# EAGLE schematic citizen-scientist-v2 (EAGLE 9.6.2)
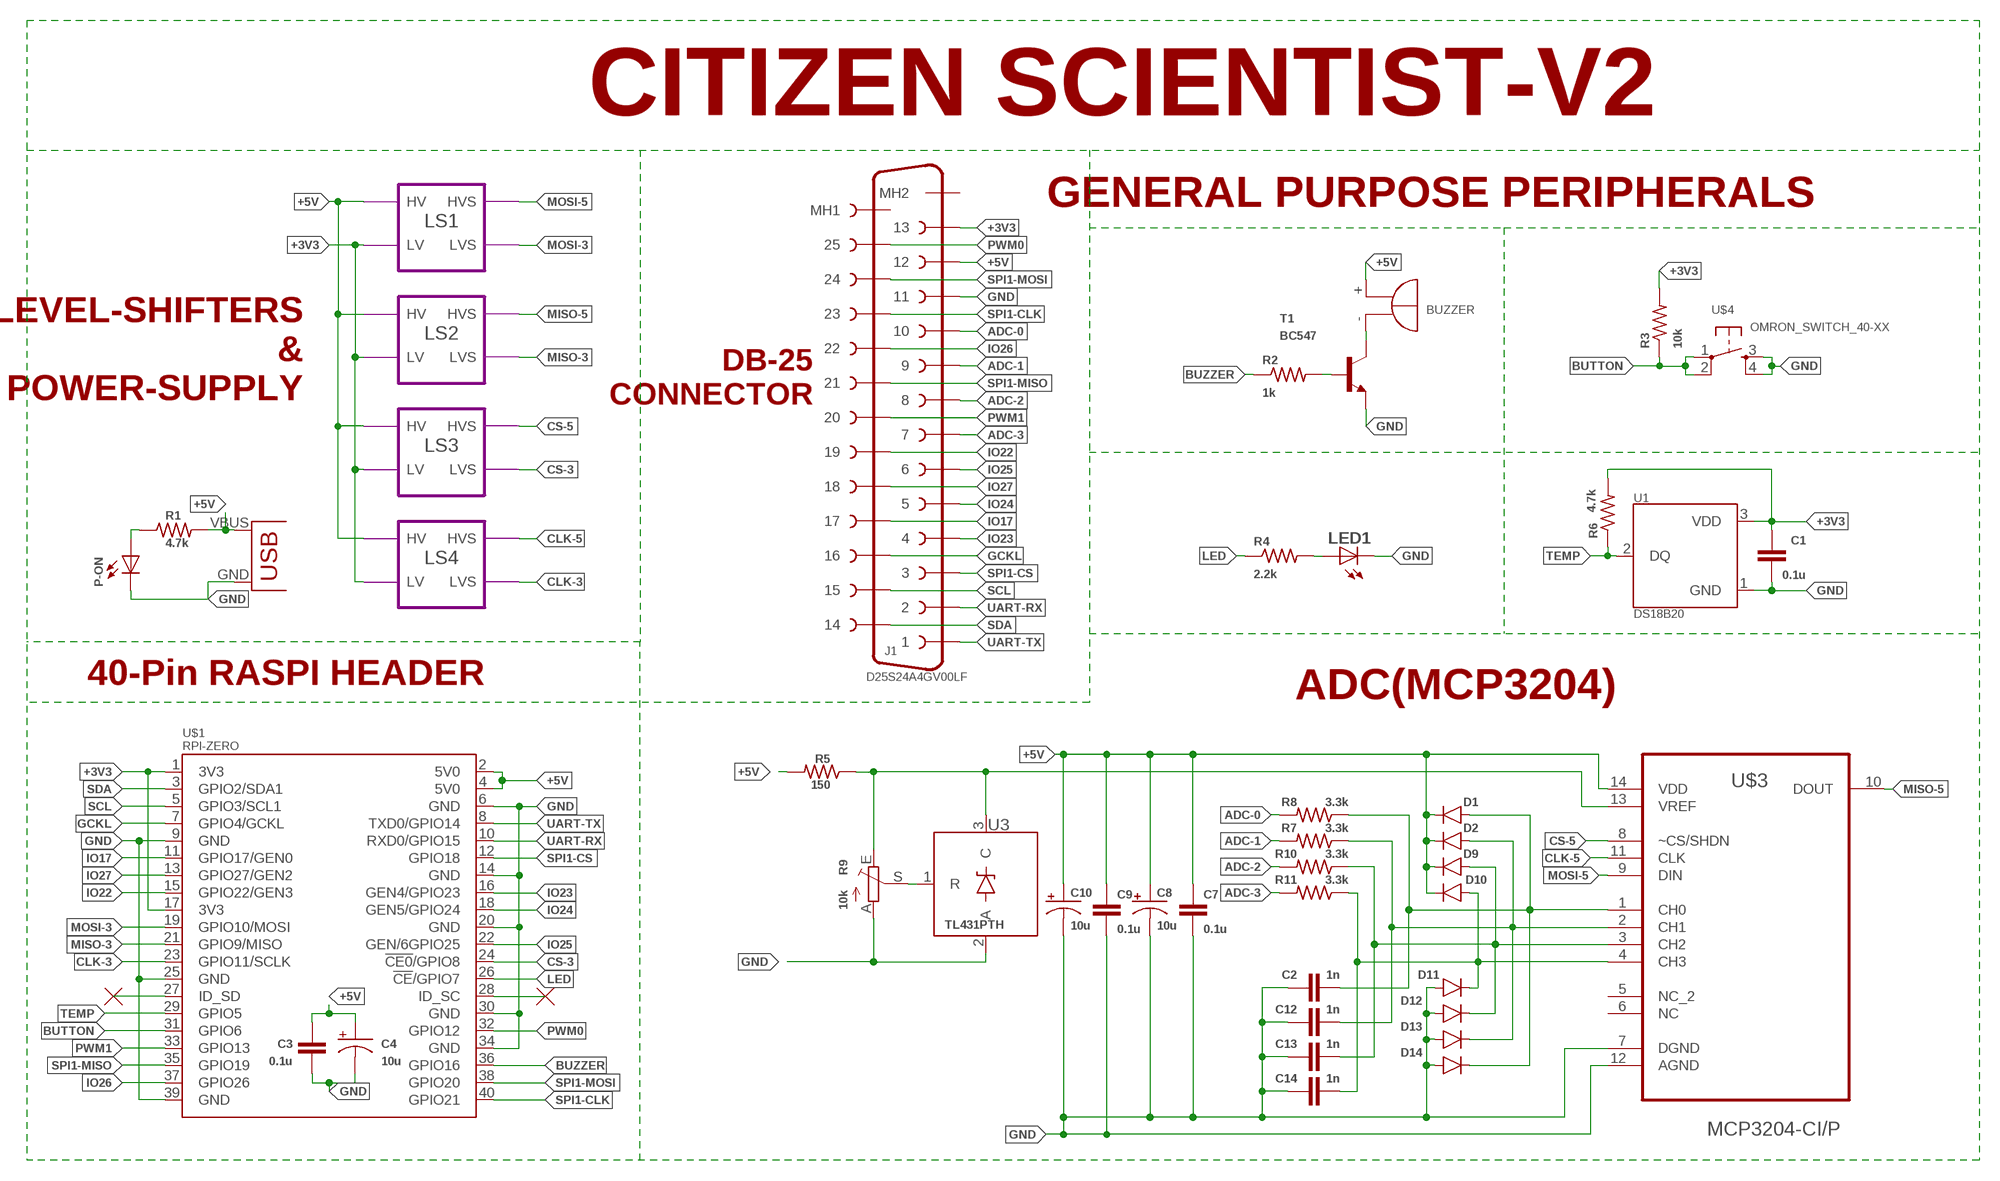
[diagram p0: schematic, sheet 1]

## Parts
BUZZER  BUZZER  [F/TMB]
C1  0.1u  C-EUC0805  [C0805]
C2  1n  C-EUC0805  [C0805]
C3  0.1u  C-EUC0805  [C0805]
C4  10u  CPOL-USB/3528-21R  [B/3528-21R]
C7  0.1u  C-EUC0805K  [C0805K]
C8  10u  CPOL-USB/3528-21R  [B/3528-21R]
C9  0.1u  C-EUC0805K  [C0805K]
C10  10u  CPOL-USB/3528-21R  [B/3528-21R]
C12  1n  C-EUC0805  [C0805]
C13  1n  C-EUC0805  [C0805]
C14  1n  C-EUC0805  [C0805]
D1  DIODE1N4148  [DIODE-1N4148]
D2  DIODE1N4148  [DIODE-1N4148]
D9  DIODE1N4148  [DIODE-1N4148]
D10  DIODE1N4148  [DIODE-1N4148]
D11  DIODE1N4148  [DIODE-1N4148]
D12  DIODE1N4148  [DIODE-1N4148]
D13  DIODE1N4148  [DIODE-1N4148]
D14  DIODE1N4148  [DIODE-1N4148]
J1  D25S24A4GV00LF  [D25S24A4GV00LF]
LED1  LED5MM  [LED5MM]
P-ON  LED3MM  [LED3MM]
R1  4.7k  R-US_0204/7  [0204/7]
R2  1k  R-US_M0805  [M0805]
R3  10k  R-US_M0805  [M0805]
R4  2.2k  R-US_0204/7  [0204/7]
R5  150  R-US_0204/7  [0204/7]
R6  4.7k  R-US_0204/7  [0204/7]
R7  3.3k  R-US_0204/7  [0204/7]
R8  3.3k  R-US_0204/7  [0204/7]
R9  10k  TRIM_EU-RJ9W  [RJ9W]
R10  3.3k  R-US_0204/7  [0204/7]
R11  3.3k  R-US_0204/7  [0204/7]
T1  BC547  [TO92]
U1  DS18B20  [TO-92-TO92127P495H2044-3]
U3  TL431PTH  [TO-92]
U$1  RPI-ZERO  [RASP_PI_ZERO_BOARD_FULL]
U$2  USB(POWER)  [USB(POWER)]
U$3  MCP3204-CI/P  [DIP254P762X432-14]
U$4  OMRON_SWITCH_40-XX  [B3F-40XX]

## Module instances
LS1 = LS
LS2 = LS
LS3 = LS
LS4 = LS

## Nets
+3V3: C1.1 J1.13 R3.2 R6.2 U1.3(VDD) U$1.1(3V3) U$1.17(3V3) ; port LS1.LV LS2.LV LS3.LV LS4.LV
+5V: BUZZER.+ C3.1 C4.+ C7.1 C8.+ C9.1 C10.+ D1.C D2.C D9.C D10.C J1.12 R1.2 R5.2 U$1.2(5V0) U$1.4(5V0) U$2.VBUS(VCC) U$3.14(VDD) ; port LS1.HV LS2.HV LS3.HV LS4.HV
ADC-0: J1.10 R8.2
ADC-1: J1.9 R7.2
ADC-2: J1.8 R10.2
ADC-3: J1.7 R11.2
BUTTON: R3.1 U$1.31(GPIO6) U$4.1(P) U$4.2(P1)
BUZZER: R2.1 U$1.36(GPIO16)
CLK-3: U$1.23(GPIO11/SCLK) ; port LS4.LVS
CLK-5: U$3.11(CLK) ; port LS4.HVS
CS-3: U$1.24(!CE0!/GPIO8) ; port LS3.LVS
CS-5: U$3.8(~CS/SHDN) ; port LS3.HVS
GCKL: J1.16 U$1.7(GPIO4/GCKL)
GND: C1.2 C2.1 C3.2 C4.- C7.2 C8.- C9.2 C10.- C12.1 C13.1 C14.1 D11.A D12.A D13.A D14.A J1.11 LED1.K(C) P-ON.K(C) R9.A T1.1(E) U1.1(GND) U3.2(A) U$1.6(GND) U$1.9(GND) U$1.14(GND) U$1.20(GND) U$1.25(GND) U$1.30(GND) U$1.34(GND) U$1.39(GND) U$2.GND U$3.7(DGND) U$3.12(AGND) U$4.3(S) U$4.4(S1)
IO17: J1.17 U$1.11(GPIO17/GEN0)
IO22: J1.19 U$1.15(GPIO22/GEN3)
IO23: J1.4 U$1.16(GEN4/GPIO23)
IO24: J1.5 U$1.18(GEN5/GPIO24)
IO25: J1.6 U$1.22(GEN/6GPIO25)
IO26: J1.22 U$1.37(GPIO26)
IO27: J1.18 U$1.13(GPIO27/GEN2)
LED: R4.1 U$1.26(!CE!/GPIO7)
MISO-3: U$1.21(GPIO9/MISO) ; port LS2.LVS
MISO-5: U$3.10(DOUT) ; port LS2.HVS
MOSI-3: U$1.19(GPIO10/MOSI) ; port LS1.LVS
MOSI-5: U$3.9(DIN) ; port LS1.HVS
N$1: P-ON.A R1.1
N$2: U$1.27(ID_SD)
N$4: U$1.28(ID_SC)
N$8: R9.S U3.1(R)
N$9: R5.1 R9.E U3.3(C) U$3.13(VREF)
N$10: R2.2 T1.2(B)
N$11: BUZZER.- T1.3(C)
N$12: C2.2 D1.A D14.C R8.1 U$3.1(CH0)
N$13: LED1.A R4.2
N$14: C12.2 D2.A D13.C R7.1 U$3.2(CH1)
N$16: C13.2 D9.A D12.C R10.1 U$3.3(CH2)
N$17: C14.2 D10.A D11.C R11.1 U$3.4(CH3)
PWM0: J1.25 U$1.32(GPIO12)
PWM1: J1.20 U$1.33(GPIO13)
SCL: J1.15 U$1.5(GPIO3/SCL1)
SDA: J1.14 U$1.3(GPIO2/SDA1)
SPI1-CLK: J1.23 U$1.40(GPIO21)
SPI1-CS: J1.3 U$1.12(GPIO18)
SPI1-MISO: J1.21 U$1.35(GPIO19)
SPI1-MOSI: J1.24 U$1.38(GPIO20)
TEMP: R6.1 U1.2(DQ) U$1.29(GPIO5)
UART-RX: J1.2 U$1.10(RXD0/GPIO15)
UART-TX: J1.1 U$1.8(TXD0/GPIO14)
Unconnected: J1.MH1 J1.MH2 U$3.5(NC_2) U$3.6(NC)

## Notes on the sheet
- CITIZEN SCIENTIST-V2
- GENERAL PURPOSE PERIPHERALS
- LEVEL-SHIFTERS
           &
  POWER-SUPPLY
- DB-25
  CONNECTOR
- 40-Pin RASPI HEADER | ADC(MCP3204)

## Library data of the parts
BUZZER = CEDT_JANUARY_2015_v5:BUZZER: BUZZER Source: Buerklin; OC_FARNELL: unknown; OC_NEWARK: unknown
C1-C3 C7 C9 C12-C14 = rcl:C-EU: CAPACITOR, European symbol; SPICEPREFIX: C
C4 C8 C10 = rcl:CPOL-US: POLARIZED CAPACITOR, American symbol; SPICEPREFIX: C
D1 D2 D9-D14 = BeagleBone_Blue_R3:DIODE: Diode These are standard reverse protection diodes and small signal diodes. SMA package can handle up to about 1A. SOD-323 can handle about 200mA. What the SOD-323 package when ordering, there are some mfgs out there that are 5-pin packages.
J1 = Connector_D-Sub:D25S24A4GV00LF: D-SUB, 25POS, RCPT, VERT SLDR Datasheet <https://cdn.amphenol-icc.com/media/wysiwyg/files/documentation/datasheet/inputoutput/io_dsub_d8656.pdf> Drawing <https://cdn.amphenol-icc.com/media/wysiwyg/files/drawing/c01-8646-0815.pdf>; CATEGORY: Connector; DESCRIPTION: 25 Position D-Sub Receptacle, Female Sockets Connector; GENDER: Female; MANUFACTURER: amphenol-icc; MPN: D25S24A4GV00LF; OPERATING_TEMP: -55°C to +125°C; PART_STATUS: Active; ROHS_COMPLIANT: EU RoHS With Exemption 6c; SERIES: DELTA D; SUB-CATEGORY: D-SUB; TYPE: Vertical
LED1 = adafruit:LED: LED OSRAM: - CHIPLED LG R971, LG N971, LY N971, LG Q971, LY Q971, LO R971, LY R971 LH N974, LH R974 LS Q976, LO Q976, LY Q976 LO Q996 - Hyper CHIPLED LW Q18S LB Q993, LB Q99A, LB R99A - SideLED LS A670, LO A670, LY A670, LG A670, LP A670 LB A673, LV A673, LT A673, LW A673 LH A674 LY A675 LS A676, LA A676, LO A676, LY A676, LW A676 LS A679, LY A679, LG A679 - Hyper Micro SIDELED® LS Y876, LA Y876, LO Y876, LY Y876 LT Y87S - SmartLED LW L88C, LW L88S LB L89C, LB L89S, LG L890 LS L89K, LO L89K, LY L89K LS L896, LA L896, LO L896, LY L896 - TOPLED LS T670, LO T670, LY T670, LG T670, LP T670 LSG T670, LSP T670, LSY T670, LOP T670, LYG T670 LG T671, LOG T671, LSG T671 LB T673, LV T673, LT T673, LW T673 LH T674 LS T676, LA T676, LO T676, LY T676, LB T676, LH T676, LSB T676, LW T676 LB T67C, LV T67C, LT T67C, LS T67K, LO T67K, LY T67K, LW E67C LS E67B, LA E67B, LO E67B, LY E67B, LB E67C, LV E67C, LT E67C LW T67C LS T679, LY T679, LG T679 LS T770, LO T770, LY T770, LG T770, LP T770 LB T773, LV T773, LT T773, LW T773 LH T774 LS E675, LA E675, LY E675, LS T675 LS T776, LA T776, LO T776, LY T776, LB T776 LHGB T686 LT T68C, LB T68C - Hyper Mini TOPLED® LB M676 - Mini TOPLED Santana® LG M470 LS M47K, LO M47K, LY M47K Source: http://www.osram.convergy.de/
P-ON = CEDT_JANUARY_2015_v5:LED
R1-R8 R10 R11 = rcl:R-US_: RESISTOR, American symbol; SPICEPREFIX: R
R9 = pot:TRIM_EU-: POTENTIOMETER
T1 = transistor:BC547: NPN TRANSISTOR
U1 = DS18B20:DS18B20: digital thermometer -55C-125C TO92-3 Check availability <https://pricing.snapeda.com/parts/DS18B20/Maxim/view-part?ref=eda>; AVAILABILITY: In Stock; DESCRIPTION: Temperature Sensor Digital, Local -55°C ~ 125°C 12 b 8-uMAX-EP|8-uSOP-EP; MF: Maxim; MP: DS18B20; PACKAGE: TO-226-3 Maxim; PRICE: None; PURCHASE-URL: https://pricing.snapeda.com/search/part/DS18B20/?ref=eda
U3 = SparkFun-DiscreteSemi:TL431: TL431- Voltage Reference Precision Programmable Shunt Regulator Diode Datasheet <https://cdn.sparkfun.com/datasheets/Components/General%20IC/TL431-D.pdf> SparkFun Products: TL431-Voltage Reference PTH <https://www.sparkfun.com/products/11078> SparkFun Uh-Oh Battery Level Indicator <https://www.sparkfun.com/products/11087>; PROD_ID: IC-10947; SF_ID: COM-11078
U$1 = rpi-zero:RPI-ZERO
U$2 = CEDT_JANUARY_2015_v5:USB(POWER)
U$3 = MCP3204-CI_P:MCP3204-CI/P: A/D Converters Check availability <https://pricing.snapeda.com/parts/MCP3204-CI/P/Microchip/view-part?ref=eda>; AVAILABILITY: In Stock; DESCRIPTION: 12 Bit Analog to Digital Converter 2, 4 Input 1 SAR 14-PDIP; MF: Microchip; MP: MCP3204-CI/P; PACKAGE: DIP-14 Microchip; PRICE: None; PURCHASE-URL: https://pricing.snapeda.com/search/part/MCP3204-CI/P/?ref=eda
U$4 = CEDT_JANUARY_2015_v5:OMRON_SWITCH

## Module LS
Ports: HV(pwr) LV(pwr) HVS(io) LVS(io)
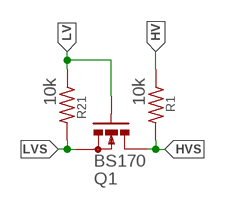
[diagram p1: schematic, module LS, sheet 1]

### Parts
Q1  BS170  [SOT54E]
R1  10k  R-US_0204/7  [0204/7]
R21  10k  R-US_0204/7  [0204/7]

### Nets
HV: R1.1
HVS: Q1.D R1.2
LV: Q1.G R21.1
LVS: Q1.S R21.2

### Library data of the parts
Q1 = transistor-small-signal:BS170: N-CHANNEL MOS FET
R1 R21 = rcl:R-US_: RESISTOR, American symbol; SPICEPREFIX: R

## Net classes
0 default: width 0.406 mm